# Altium project 24.063.PrjPCB
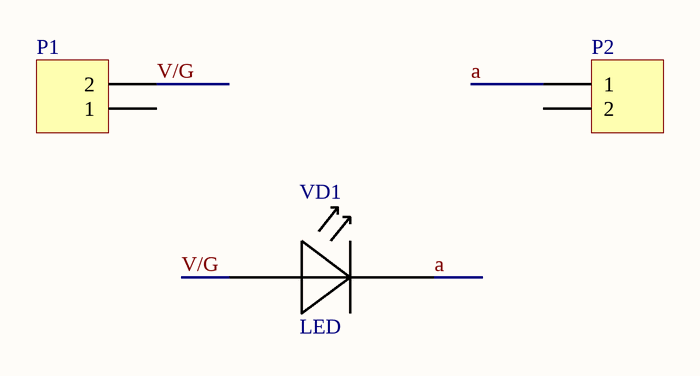
[diagram p0: 24.063.SchDoc]
1 sheet, 3 parts. Net scope: global (net labels, ports and power ports of the same name join across sheets).
Board file: 24.063.PcbDoc

## Sheet 24.063.SchDoc
size A4

### Parts
P1  Header 2  [HDR1X2]  (value not drawn)
P2  Header 2  [HDR1X2]  (value not drawn)
VD1  LED  [LED 24.063]

### Nets
a: P2.1 VD1.2
V/G: P1.2 VD1.1

Not connected (* = marked no-connect by the designer): P1 1; P2 2

### Library data of the parts
P1 P2 = Header 2: Header, 2-Pin; LatestRevisionDate: 17-Jul-2002; LatestRevisionNote: Re-released for DXP Platform.; Publisher: Altium Limited